# EAGLE design M621A (EAGLE 6.6.0)
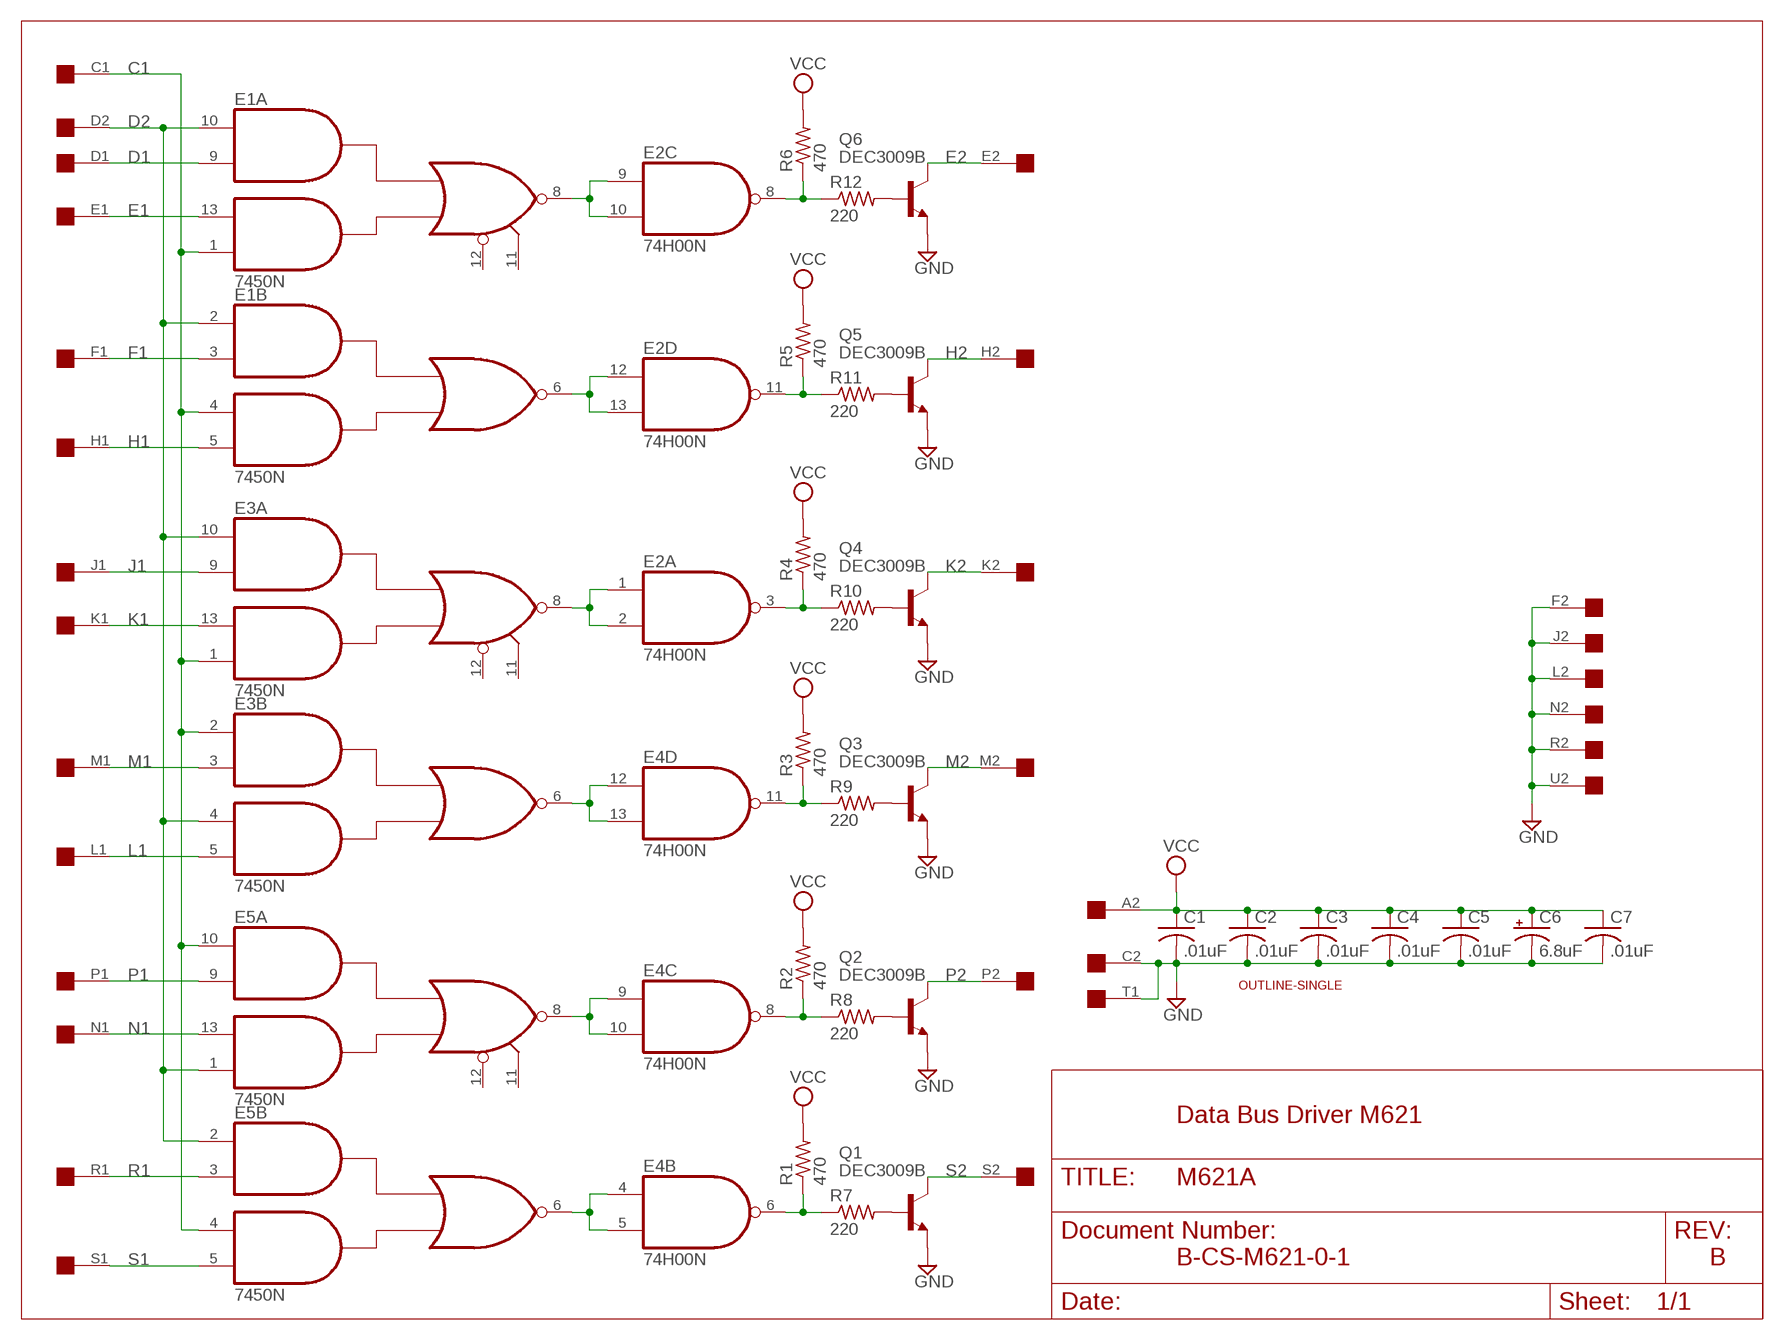
[diagram p0: schematic, sheet 1]

## Parts
C1  .01uF  C-US  [C063-025X075]
C2  .01uF  C-US  [C063-025X075]
C3  .01uF  C-US  [C063-025X075]
C4  .01uF  C-US  [C063-025X075]
C5  .01uF  C-US  [C063-025X075]
C6  6.8uF  CPOL-USE15-5AXIAL  [E15-5]
C7  .01uF  C-US  [C063-025X075]
E1  7450N  [DIL14]
E2  74H00N  74S00N  [DIL14]
E3  7450N  [DIL14]
E4  74H00N  74S00N  [DIL14]
E5  7450N  [DIL14]
Q1  DEC3009B  -NPN-TO5  [TO5]
Q2  DEC3009B  -NPN-TO5  [TO5]
Q3  DEC3009B  -NPN-TO5  [TO5]
Q4  DEC3009B  -NPN-TO5  [TO5]
Q5  DEC3009B  -NPN-TO5  [TO5]
Q6  DEC3009B  -NPN-TO5  [TO5]
R1  470  R-US_0207/10  [0207/10]
R2  470  R-US_0207/10  [0207/10]
R3  470  R-US_0207/10  [0207/10]
R4  470  R-US_0207/10  [0207/10]
R5  470  R-US_0207/10  [0207/10]
R6  470  R-US_0207/10  [0207/10]
R7  220  R-US_0207/10  [0207/10]
R8  220  R-US_0207/10  [0207/10]
R9  220  R-US_0207/10  [0207/10]
R10  220  R-US_0207/10  [0207/10]
R11  220  R-US_0207/10  [0207/10]
R12  220  R-US_0207/10  [0207/10]
U$1  OUTLINE-SINGLE  [SINGLE]
U$2  edge  SINGLE  [EDGE-CON2]

## Nets
C1: E1.1(A:I4) E1.4(B:I3) E3.1(A:I4) E3.2(B:I1) E5.4(B:I3) E5.10(A:I1) U$2.C1
D1: E1.9(A:I2) U$2.D1
D2: E1.2(B:I1) E1.10(A:I1) E3.4(B:I3) E3.10(A:I1) E5.1(A:I4) E5.2(B:I1) U$2.D2
E1: E1.13(A:I3) U$2.E1
E2: Q6.3(C) U$2.E2
F1: E1.3(B:I2) U$2.F1
GND [supply]: C1.2 C2.2 C3.2 C4.2 C5.2 C6.- C7.2 Q1.1(E) Q2.1(E) Q3.1(E) Q4.1(E) Q5.1(E) Q6.1(E) U$2.C2 U$2.F2 U$2.J2 U$2.L2 U$2.N2 U$2.R2 U$2.T1 U$2.U2
H1: E1.5(B:I4) U$2.H1
H2: Q5.3(C) U$2.H2
J1: E3.9(A:I2) U$2.J1
K1: E3.13(A:I3) U$2.K1
K2: Q4.3(C) U$2.K2
L1: E3.5(B:I4) U$2.L1
M1: E3.3(B:I2) U$2.M1
M2: Q3.3(C) U$2.M2
N1: E5.13(A:I3) U$2.N1
N$1: E2.8(C:O) R6.1 R12.1
N$2: E2.11(D:O) R5.1 R11.1
N$3: E2.3(A:O) R4.1 R10.1
N$4: E4.11(D:O) R3.1 R9.1
N$5: E4.8(C:O) R2.1 R8.1
N$6: E4.6(B:O) R1.1 R7.1
N$7: Q1.2(B) R7.2
N$8: Q2.2(B) R8.2
N$9: Q3.2(B) R9.2
N$10: Q4.2(B) R10.2
N$11: Q5.2(B) R11.2
N$12: Q6.2(B) R12.2
N$13: E1.6(B:O) E2.12(D:I0) E2.13(D:I1)
N$14: E1.8(A:O) E2.9(C:I0) E2.10(C:I1)
N$18: E2.1(A:I0) E2.2(A:I1) E3.8(A:O)
N$20: E3.6(B:O) E4.12(D:I0) E4.13(D:I1)
N$25: E4.9(C:I0) E4.10(C:I1) E5.8(A:O)
N$27: E4.4(B:I0) E4.5(B:I1) E5.6(B:O)
P1: E5.9(A:I2) U$2.P1
P2: Q2.3(C) U$2.P2
R1: E5.3(B:I2) U$2.R1
S1: E5.5(B:I4) U$2.S1
S2: Q1.3(C) U$2.S2
VCC [supply]: C1.1 C2.1 C3.1 C4.1 C5.1 C6.+ C7.1 R1.2 R2.2 R3.2 R4.2 R5.2 R6.2 U$2.A2
Unconnected: E1.11(A:I6) E1.12(A:I5) E2.4(B:I0) E2.5(B:I1) E2.6(B:O) E3.11(A:I6) E3.12(A:I5) E4.1(A:I0) E4.2(A:I1) E4.3(A:O) E5.11(A:I6) E5.12(A:I5) U$2.A1 U$2.B1 U$2.B2 U$2.T2 U$2.U1 U$2.V1 U$2.V2

## Notes on the sheet
- Data Bus Driver M621
- B-CS-M621-0-1 | B

## Power pins joined to a net without a drawn wire
GND: E1.7(P:GND) E2.7(P:GND) E3.7(P:GND) E4.7(P:GND) E5.7(P:GND)
VCC: E1.14(P:VCC) E2.14(P:VCC) E3.14(P:VCC) E4.14(P:VCC) E5.14(P:VCC)

## Library data of the parts
C1-C5 C7 = dec-con:C-US: Capacitor with funky DEC lead spacing.
C6 = dec-con:CPOL-USE15-5AXIAL: 0.6" veresion of an electrolytic
E1 E3 E5 = dec-con:74*50: 4-2-3-2 input AND OR INVERTER gates
E2 E4 = 74xx-us:74*00: Quad 2-input NAND gate
Q1-Q6 = transistor:*-NPN-: NPN Transistror BF959 corrected 2008.03.06
R1-R12 = rcl:R-US_: RESISTOR, American symbol
U$1 = dec-con:OUTLINE-*: Board outlines for DEC boards.
U$2 = dec-con:SINGLE: Single-Height DEC board

## Net classes
1 supply: width 0.813 mm

## Board
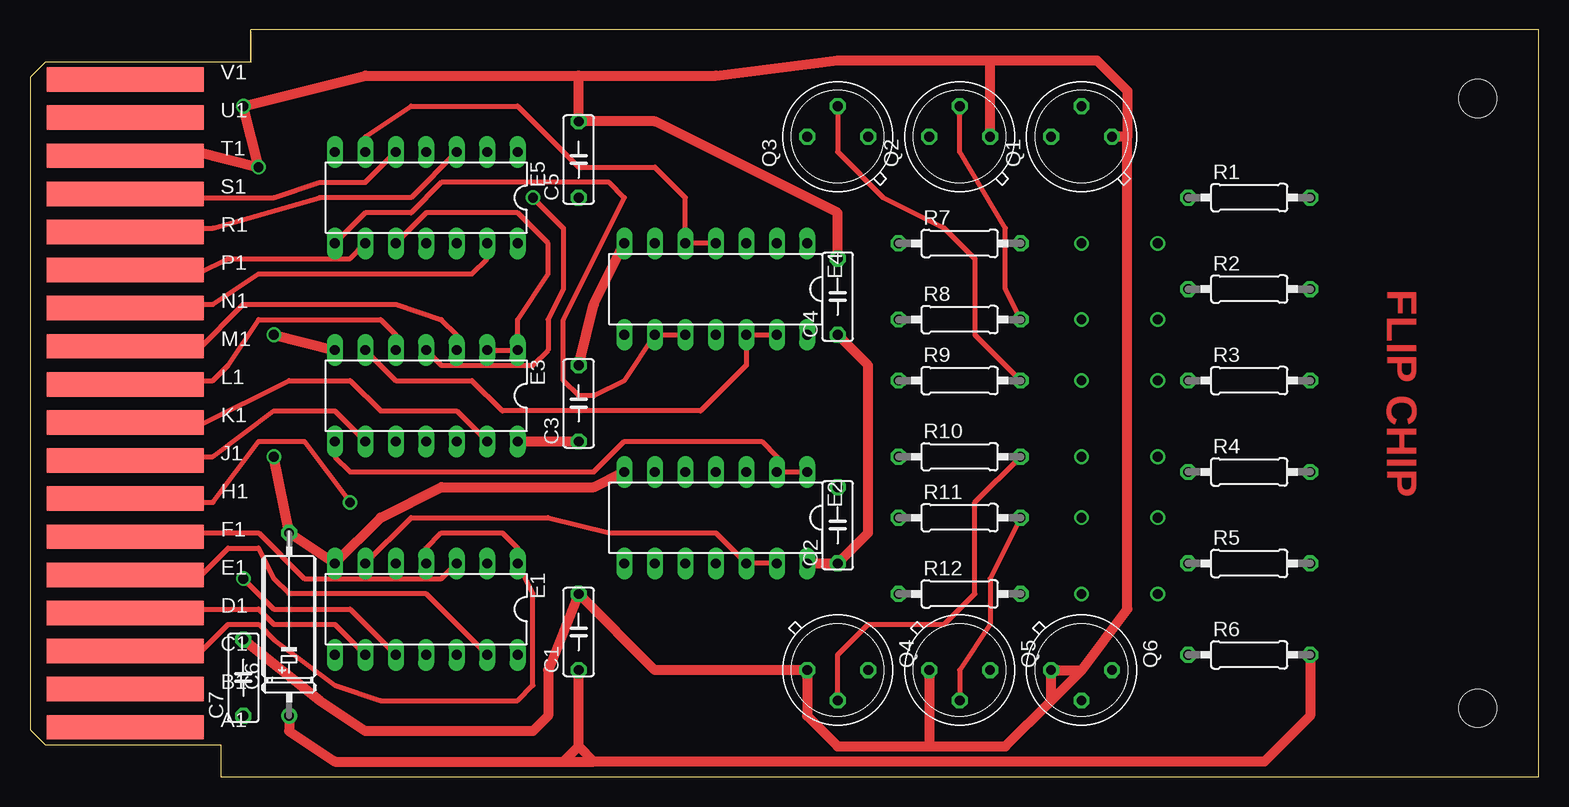
[diagram p1: board, top side]
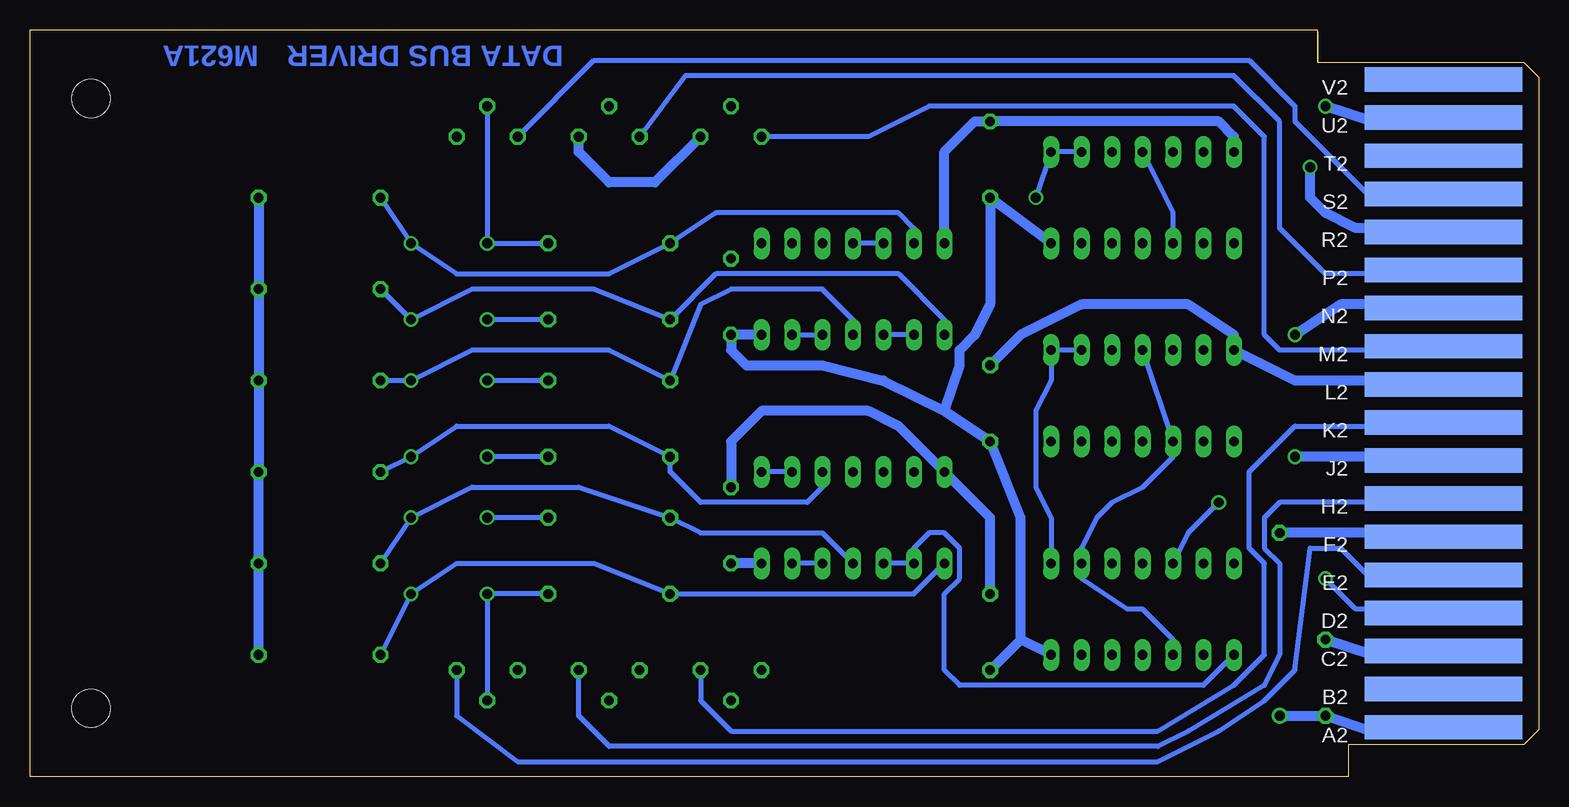
[diagram p2: board, bottom side, seen from below]

Size 125.73 x 62.23 mm. Coordinates in mm from the lower left corner, seen from the top.
Copper layers (1+16): Top 0.035mm / dielectric 1.5mm / Bottom 0.035mm
Design rules "16mils": minimum track width 16mil, minimum drill 32mil, track to track 15mil, track to pad 10mil, pad to pad 10mil, via to via 10mil, smd to smd 10mil, copper to edge 13mil, drill to drill 10mil, minimum pad ring 10mil, minimum via ring 8mil, stop-mask expansion 0mil, vias tented up to drill 0mil, thermal gap 10mil

### Footprints (pad centres in the part's own frame; a part is rotated, then mirrored left to right if it is on the bottom)
C063-025X075 = drill 0.813 octagon: 1 -2.54,0; 2 3.81,0
E15-5 = drill 0.813: + -7.62,0 | drill 0.813 octagon: - 7.62,0
DIL14 = drill 0.813 long: 1 -7.62,-3.81; 2 -5.08,-3.81; 3 -2.54,-3.81; 4 0,-3.81; 5 2.54,-3.81; 6 5.08,-3.81; 7 7.62,-3.81; 8 7.62,3.81; 9 5.08,3.81; 10 2.54,3.81; 11 0,3.81; 12 -2.54,3.81; 13 -5.08,3.81; 14 -7.62,3.81
TO5 = drill 0.813 octagon: 1 0,-2.54; 2 2.54,0; 3 0,2.54
0207/10 = drill 0.813 octagon: 1 -5.08,0; 2 5.08,0
SINGLE = hole 3.175: 120.65,56.515; 120.65,5.715
EDGE-CON2 = smd 13.106 x 2.032: A1 7.938,4.128; B1 7.938,7.303; C1 7.938,10.477; D1 7.938,13.652; E1 7.938,16.828; F1 7.938,20.003; H1 7.938,23.177; J1 7.938,26.352; K1 7.938,29.527; L1 7.938,32.703; M1 7.938,35.877; N1 7.938,39.053; P1 7.938,42.227; R1 7.938,45.403; S1 7.938,48.578; T1 7.938,51.752; U1 7.938,54.928; V1 7.938,58.102 | smd 13.106 x 2.032 bottom: A2 7.938,4.128; B2 7.938,7.303; C2 7.938,10.477; D2 7.938,13.652; E2 7.938,16.828; F2 7.938,20.003; H2 7.938,23.177; J2 7.938,26.352; K2 7.938,29.527; L2 7.938,32.703; M2 7.938,35.877; N2 7.938,39.053; P2 7.938,42.227; R2 7.938,45.403; S2 7.938,48.578; T2 7.938,51.752; U2 7.938,54.928; V2 7.938,58.102

### Placement (x,y rotation side)
C1  45.72,11.43 90 top
C2  67.31,20.32 90 top
C3  45.72,30.48 90 top
C4  67.31,39.37 90 top
C5  45.72,50.8 90 top
C6  21.59,12.7 90 top
C7  17.78,7.62 90 top
E1  33.02,13.97 180 top
E2  57.15,21.59 180 top
E3  33.02,31.75 180 top
E4  57.15,40.64 180 top
E5  33.02,48.26 180 top
Q1  87.63,53.34 90 top
Q2  77.47,53.34 90 top
Q3  67.31,53.34 90 top
Q4  67.31,8.89 270 top
Q5  77.47,8.89 270 top
Q6  87.63,8.89 270 top
R1  101.6,48.26 0 top
R2  101.6,40.64 0 top
R3  101.6,33.02 0 top
R4  101.6,25.4 0 top
R5  101.6,17.78 0 top
R6  101.6,10.16 0 top
R7  77.47,44.45 0 top
R8  77.47,38.1 0 top
R9  77.47,33.02 0 top
R10  77.47,26.67 0 top
R11  77.47,21.59 0 top
R12  77.47,15.24 0 top
U$1  0,0 0 top
U$2  0,0 0 top

### Tracks (layer width: path | path; a pad name or v marks a point on that pad's centre or on a via)
C1
  Top 0.406: E3.2 E3.1 40.64,38.1 43.18,41.91 43.18,44.45 40.64,46.99 33.02,46.99 E5.10 | U$2.C1 8.89,10.16 13.97,10.16 16.51,12.7 19.05,12.7 20.32,11.43 25.4,7.62 29.21,6.35 40.64,6.35 41.91,7.62 41.91,15.24 E1.1 40.64,19.05 39.37,20.32 34.29,20.32 33.02,19.05 E1.4
  Bottom 0.406: E1.1 40.64,21.59 41.91,24.13 41.91,30.48 40.64,33.02 E3.1 E3.2 | E5.10 30.48,46.99 E5.4
D1
  Top 0.406: U$2.D1 8.89,13.97 19.05,13.97 20.32,12.7 25.4,12.7 E1.9
D2  (via drill 0.81)
  Top 0.406: v17.78,16.51 20.32,13.97 26.67,13.97 E1.10 | v41.91,48.26 44.45,45.72 44.45,40.64 43.18,38.1 43.18,35.56 41.91,34.29 34.29,34.29 E3.4
  Bottom 0.406: E1.10 30.48,11.43 33.02,13.97 34.29,13.97 38.1,16.51 E1.2 38.1,19.05 36.83,21.59 35.56,22.86 33.02,24.13 30.48,26.67 E3.10 E3.4 | U$2.D2 10.16,13.97 15.24,13.97 v17.78,16.51 | E5.2 E5.1 v41.91,48.26
E1
  Top 0.406: U$2.E1 8.89,16.51 13.97,16.51 16.51,19.05 19.05,19.05 20.32,16.51 21.59,15.24 33.02,15.24 E1.13
E2
  Bottom 0.406: Q6.3 90.17,5.08 85.09,1.27 31.75,1.27 26.67,3.81 22.86,6.35 20.32,8.89 19.05,19.05 16.51,19.05 13.97,16.51 8.89,16.51 U$2.E2
F1
  Top 0.406: U$2.F1 8.89,20.32 19.05,20.32 22.86,16.51 34.29,16.51 E1.3
GND  (via drill 0.81)
  Top 0.813: C7.2 24.13,6.35 27.94,3.81 41.91,3.81 43.18,5.08 43.18,8.89 C1.2 52.07,8.89 Q4.1 64.77,5.08 67.31,2.54 74.93,2.54 | 74.93,2.54 81.28,2.54 85.09,6.35 | 85.09,6.35 Q6.1 87.63,8.89 | Q5.1 74.93,2.54 | C4.2 67.31,46.99 52.07,54.61 C5.2 45.72,58.42 | E2.7 46.99,24.13 34.29,24.13 29.21,21.59 E1.7 C6.- v20.32,26.67 | v20.32,36.83 E3.7 | U$2.T1 8.89,52.07 13.97,52.07 v19.05,50.8 v17.78,55.88 27.94,58.42 45.72,58.42 | 45.72,58.42 57.15,58.42 67.31,59.69 80.01,59.69 | 80.01,59.69 88.9,59.69 91.44,57.15 91.44,53.34 | 91.44,53.34 Q1.1 | 87.63,8.89 91.44,13.97 91.44,53.34 | 85.09,6.35 87.63,8.89 | Q2.1 80.01,59.69 | C3.2 46.99,39.37 E4.7
  Bottom 0.813: U$2.F2 8.89,20.32 C6.- | U$2.C2 8.89,10.16 13.97,10.16 C7.2 | U$2.J2 8.89,26.67 v20.32,26.67 | U$2.L2 8.89,33.02 20.32,33.02 E3.7 25.4,36.83 29.21,39.37 38.1,39.37 43.18,36.83 C3.2 | U$2.N2 8.89,39.37 16.51,39.37 v20.32,36.83 | U$2.U2 8.89,54.61 13.97,54.61 v17.78,55.88 | U$2.R2 8.89,45.72 15.24,45.72 17.78,46.99 19.05,48.26 v19.05,50.8 | E5.7 25.4,53.34 26.67,54.61 C5.2 46.99,54.61 49.53,52.07 E4.7 | C1.2 45.72,21.59 E2.7 53.34,29.21 55.88,30.48 64.77,30.48 67.31,27.94 C2.2 | Q3.1 73.66,49.53 77.47,49.53 80.01,52.07 Q2.1
H1  (via drill 0.81)
  Top 0.406: U$2.H1 10.16,22.86 15.24,22.86 19.05,27.94 22.86,27.94 v26.67,22.86
  Bottom 0.406: E1.5 29.21,20.32 v26.67,22.86
H2
  Bottom 0.406: U$2.H2 10.16,22.86 21.59,22.86 22.86,21.59 22.86,19.05 21.59,17.78 21.59,10.16 22.86,7.62 29.21,3.81 31.75,2.54 77.47,2.54 80.01,5.08 Q5.3
J1
  Top 0.406: U$2.J1 8.89,26.67 15.24,26.67 20.32,30.48 25.4,30.48 E3.9
K1
  Top 0.406: U$2.K1 10.16,29.21 13.97,29.21 21.59,33.02 26.67,33.02 29.21,30.48 35.56,30.48 E3.13
K2
  Bottom 0.406: Q4.3 69.85,6.35 67.31,3.81 31.75,3.81 25.4,7.62 22.86,10.16 22.86,17.78 24.13,19.05 24.13,20.32 24.13,21.59 24.13,24.13 24.13,25.4 22.86,26.67 20.32,29.21 8.89,29.21 U$2.K2
L1
  Top 0.406: U$2.L1 8.89,33.02 15.24,33.02 16.51,34.29 19.05,38.1 29.21,38.1 30.48,36.83 E3.5
M1
  Top 0.406: U$2.M1 8.89,35.56 13.97,35.56 17.78,39.37 30.48,39.37 34.29,38.1 35.56,36.83 E3.3
M2
  Bottom 0.406: U$2.M2 10.16,35.56 21.59,35.56 22.86,36.83 22.86,53.34 25.4,55.88 50.8,55.88 55.88,53.34 Q3.3
N1
  Top 0.406: U$2.N1 8.89,39.37 15.24,39.37 19.05,41.91 36.83,41.91 38.1,43.18 E5.13
N$1  (via drill 0.81)
  Bottom 0.406: R6.1 v93.98,15.24 90.17,17.78 78.74,17.78 R12.1 52.07,15.24 E2.8
N$2  (via drill 0.81)
  Bottom 0.406: R5.1 v93.98,21.59 88.9,24.13 80.01,24.13 R11.1 69.85,20.32 59.69,20.32 E2.11
N$3  (via drill 0.81)
  Bottom 0.406: R4.1 v93.98,26.67 90.17,29.21 77.47,29.21 R10.1 72.39,25.4 69.85,22.86 60.96,22.86 59.69,24.13 E2.3
N$4  (via drill 0.81)
  Bottom 0.406: E4.11 57.15,38.1 59.69,40.64 67.31,40.64 69.85,39.37 R9.1 77.47,35.56 88.9,35.56 v93.98,33.02 R3.1
N$5  (via drill 0.81)
  Bottom 0.406: R2.1 v93.98,38.1 88.9,40.64 78.74,40.64 R8.1 68.58,41.91 53.34,41.91 49.53,38.1 E4.8
N$6  (via drill 0.81)
  Bottom 0.406: R1.1 v93.98,44.45 90.17,41.91 77.47,41.91 R7.1 68.58,46.99 53.34,46.99 52.07,45.72 E4.6
N$7  (via drill 0.81)
  Bottom 0.406: Q1.2 v87.63,44.45 R7.2
N$8  (via drill 0.81)
  Top 0.406: R8.2 81.28,40.64 81.28,45.72 77.47,52.07 Q2.2
  Bottom 0.406: R8.2 v87.63,38.1
N$9  (via drill 0.81)
  Top 0.406: Q3.2 67.31,52.07 71.12,48.26 76.2,45.72 78.74,43.18 78.74,36.83 R9.2
  Bottom 0.406: R9.2 v87.63,33.02
N$10  (via drill 0.81)
  Top 0.406: Q4.2 67.31,10.16 69.85,12.7 76.2,12.7 78.74,15.24 78.74,22.86 R10.2
  Bottom 0.406: R10.2 v87.63,26.67
N$11  (via drill 0.81)
  Top 0.406: R11.2 80.01,16.51 80.01,12.7 77.47,8.89 Q5.2
  Bottom 0.406: R11.2 v87.63,21.59
N$12  (via drill 0.81)
  Bottom 0.406: R12.2 v87.63,15.24 Q6.2
N$13
  Top 0.406: E2.13 E2.12 57.15,20.32 48.26,20.32 43.18,21.59 31.75,21.59 E1.6
  Bottom 0.406: E2.12 E2.13
N$14
  Bottom 0.406: E1.8 27.94,7.62 48.26,7.62 49.53,8.89 49.53,15.24 48.26,16.51 48.26,19.05 49.53,20.32 50.8,20.32 52.07,19.05 E2.9 E2.10
N$18
  Top 0.406: E2.1 E2.2 62.23,26.67 60.96,27.94 49.53,27.94 46.99,25.4 26.67,25.4 25.4,26.67 E3.8
  Bottom 0.406: E2.2 E2.1
N$20
  Top 0.406: E4.13 E4.12 59.69,34.29 55.88,30.48 39.37,30.48 36.83,33.02 30.48,33.02 E3.6
  Bottom 0.406: E4.13 E4.12
N$25
  Top 0.406: E4.10 E4.9 49.53,33.02 46.99,31.75 45.72,31.75 44.45,33.02 44.45,38.1 49.53,48.26 48.26,49.53 34.29,49.53 31.75,46.99 27.94,46.99 E5.8
  Bottom 0.406: E4.9 E4.10
N$27
  Top 0.406: E4.4 E4.5 54.61,48.26 52.07,50.8 45.72,50.8 40.64,55.88 31.75,55.88 27.94,53.34 E5.6
  Bottom 0.406: E4.5 E4.4
P1
  Top 0.406: U$2.P1 8.89,41.91 13.97,41.91 16.51,43.18 26.67,43.18 E5.9
P2
  Bottom 0.406: U$2.P2 8.89,41.91 17.78,41.91 21.59,45.72 21.59,54.61 25.4,58.42 71.12,58.42 Q2.3
R1
  Top 0.406: U$2.R1 8.89,45.72 15.24,45.72 24.13,48.26 31.75,48.26 E5.3
S1
  Top 0.406: U$2.S1 8.89,48.26 20.32,48.26 24.13,49.53 27.94,49.53 E5.5
S2
  Bottom 0.406: Q1.3 78.74,59.69 24.13,59.69 20.32,55.88 20.32,54.61 13.97,48.26 8.89,48.26 U$2.S2
VCC
  Top 0.813: C6.+ 21.59,3.81 25.4,1.27 44.45,1.27 | 44.45,1.27 45.72,2.54 | 45.72,2.54 C1.1 | R6.2 106.68,5.08 102.87,1.27 46.99,1.27 | 46.99,1.27 45.72,2.54 | 44.45,1.27 46.99,1.27 | C4.1 69.85,34.29 69.85,20.32 C2.1 E2.14 | E3.14 C3.1
  Bottom 0.813: U$2.A2 8.89,3.81 13.97,3.81 C7.1 C6.+ | E1.14 43.18,11.43 | 43.18,11.43 43.18,21.59 C3.1 49.53,30.48 | C1.1 43.18,11.43 | 49.53,30.48 48.26,34.29 48.26,35.56 46.99,36.83 45.72,39.37 C5.1 E5.14 | E4.14 C4.1 67.31,35.56 66.04,34.29 59.69,34.29 54.61,33.02 49.53,30.48 | R1.2 R2.2 R3.2 R4.2 R5.2 R6.2 | E2.14 C2.1

### Text on the board
Top: FLIP CHIP
Bottom: DATA BUS DRIVER | M621A